# EAGLE design esquema (EAGLE 9.6.2)
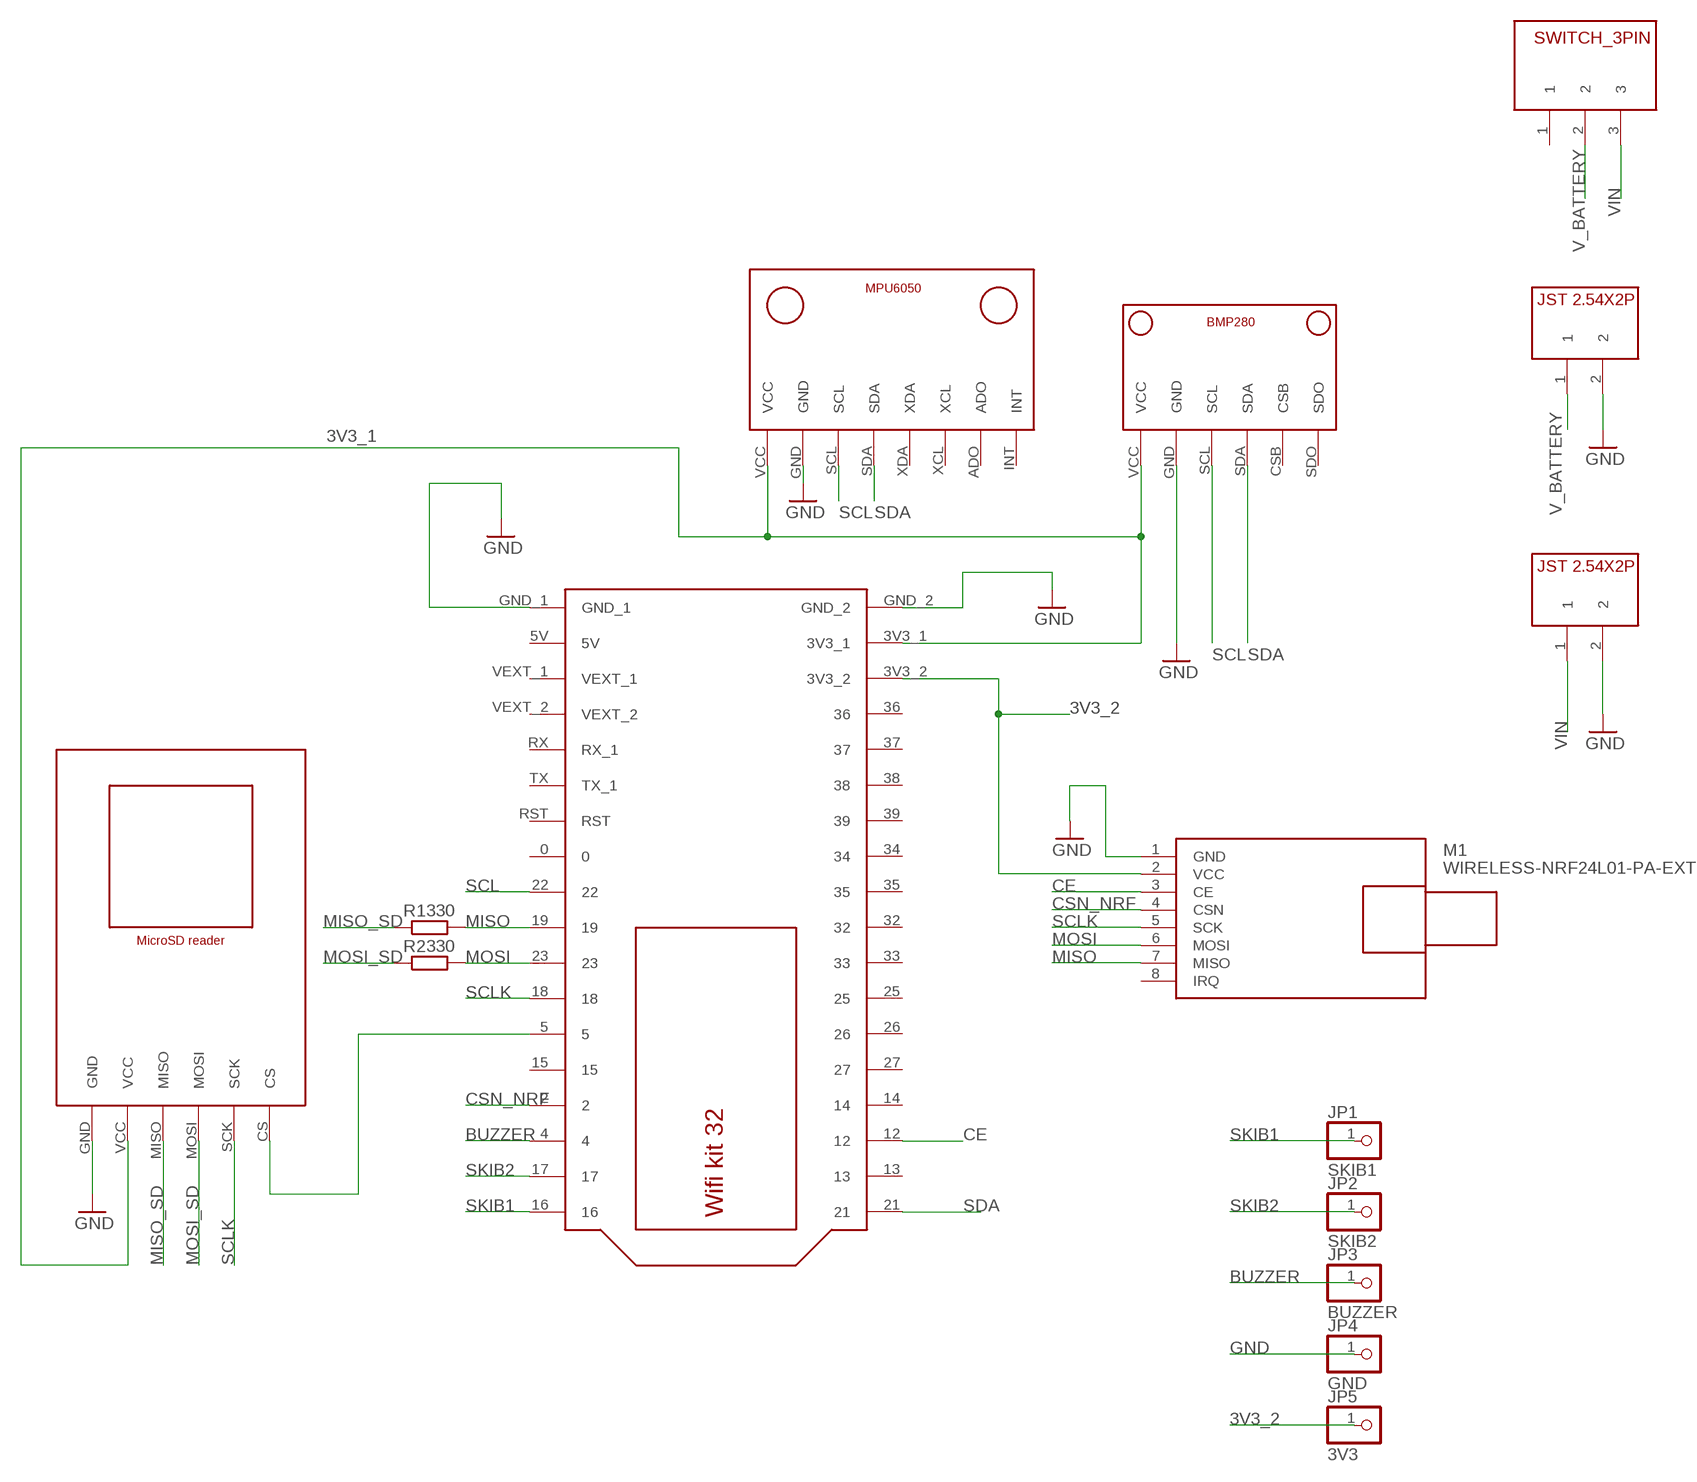
[diagram p0: schematic, sheet 1]

## Parts
JP1  SKIB1  PINHD-1X1  [1X01]
JP2  SKIB2  PINHD-1X1  [1X01]
JP3  BUZZER  PINHD-1X1  [1X01]
JP4  GND  PINHD-1X1  [1X01]
JP5  3V3  PINHD-1X1  [1X01]
M1  WIRELESS-NRF24L01-PA-EXT  [WIRELESS-NRF24L01-PA-EXT]
R1  330  R-EU_0207/10  [0207/10]
R2  330  R-EU_0207/10  [0207/10]
U$1  BMP280V1  [BMP280_FOOTPRINT]
U$2  MICROSD_READER  [MICROSD_READER_FOOTPRINT]
U$3  MPU6050V1  [MPU6050_FOOTPRINT]
U$4  WIFI_KIT32  [WIFI_KIT32]
U$5  JST2.54X2P  [JST2.54X2P_FOOTPRINT]
U$6  SWITCH_3PIN  [SWITCH_3PIN]
U$7  JST2.54X2P  [JST2.54X2P_FOOTPRINT]

## Nets
3V3_1: U$1.VCC U$2.VCC U$3.VCC U$4.3V3_1
3V3_2: JP5.1 M1.2(VCC) U$4.3V3_2
BUZZER: JP3.1 U$4.4
CE: M1.3(CE) U$4.12
CSN_NRF: M1.4(CSN) U$4.2
GND: JP4.1 M1.1(GND) U$1.GND U$2.GND U$3.GND U$4.GND_1 U$4.GND_2 U$5.2 U$7.2
MISO: M1.7(MISO) R1.2 U$4.19
MISO_SD: R1.1 U$2.MISO
MOSI: M1.6(MOSI) R2.2 U$4.23
MOSI_SD: R2.1 U$2.MOSI
N$1: U$2.CS U$4.5
SCL: U$1.SCL U$3.SCL U$4.22
SCLK: M1.5(SCK) U$2.SCK U$4.18
SDA: U$1.SDA U$3.SDA U$4.21
SKIB1: JP1.1 U$4.16
SKIB2: JP2.1 U$4.17
V_BATTERY: U$5.1 U$6.2
VIN: U$6.3 U$7.1
Unconnected: M1.8(IRQ) U$1.CSB U$1.SDO U$3.ADO U$3.INT U$3.XCL U$3.XDA U$4.0 U$4.5V U$4.13 U$4.14 U$4.15 U$4.25 U$4.26 U$4.27 U$4.32 U$4.33 U$4.34 U$4.35 U$4.36 U$4.37 U$4.38 U$4.39 U$4.RST U$4.RX(RX_1) U$4.TX(TX_1) U$4.VEXT_1 U$4.VEXT_2 U$6.1

## Library data of the parts
JP1-JP5 = pinhead:PINHD-1X1: PIN HEADER
M1 = modules:WIRELESS-NRF24L01-PA-EXT: 2.4 GHz Wireless Module based on NRF24L01 chip with preamplifier and external antenna Click here to find device on ebay.com <http://www.ebay.com/sch/nrf24l01+pa+lna+sma>
R1 R2 = rcl:R-EU_: RESISTOR, European symbol; SPICEPREFIX: R
U$1 = CRD:BMP280: Sensor barométrico
U$2 = CRD:MICROSD_READER: Leitor e gravador de cartão SD
U$3 = CRD:MPU6050: Acelerômetro e Giroscópio
U$4 = CRD:WIFI_KIT32: Placa de desenvolvimento ESP32 da Heltech
U$5 U$7 = CRD:JST2.54X2P: Conector JST 2 pinos (2.54mm de distância entre pinos)
U$6 = CRD:SWITCH_3PIN

## Board
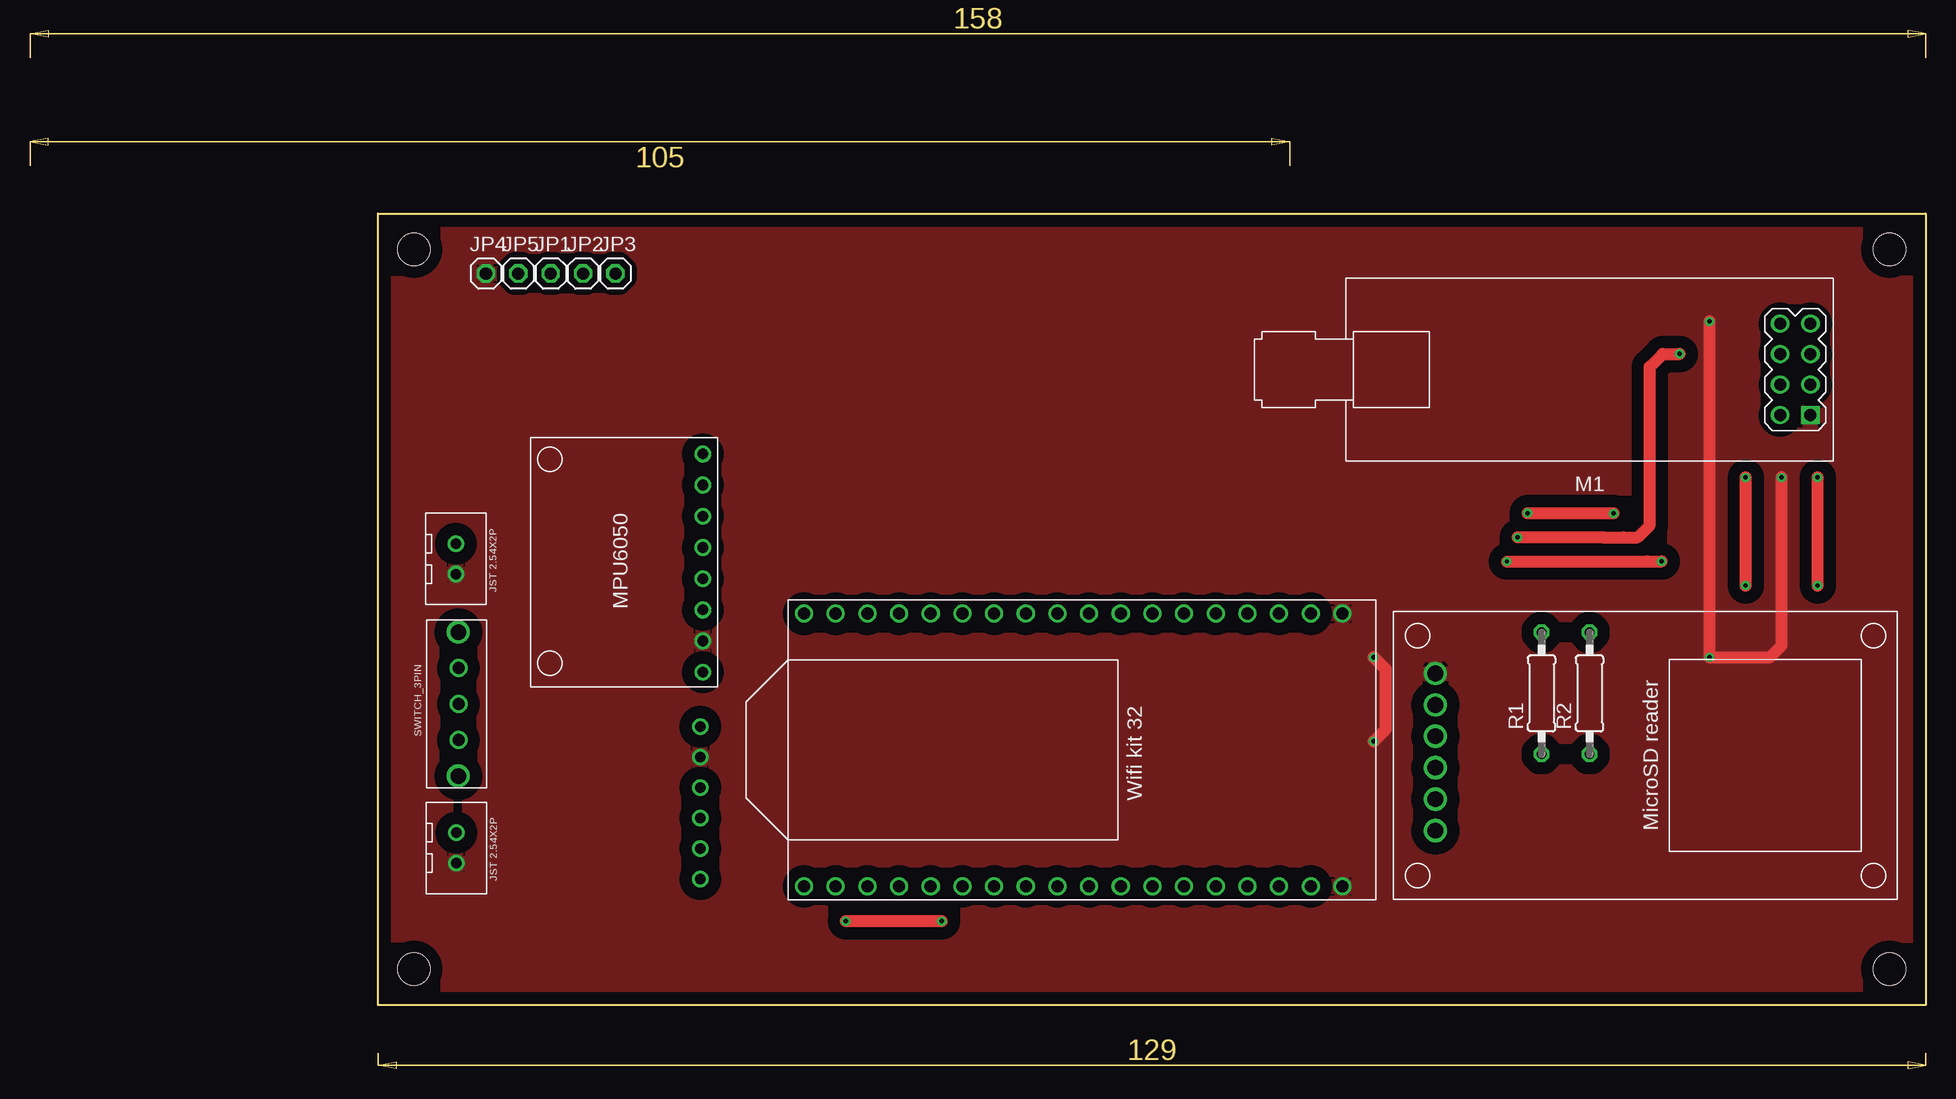
[diagram p1: board, top side]
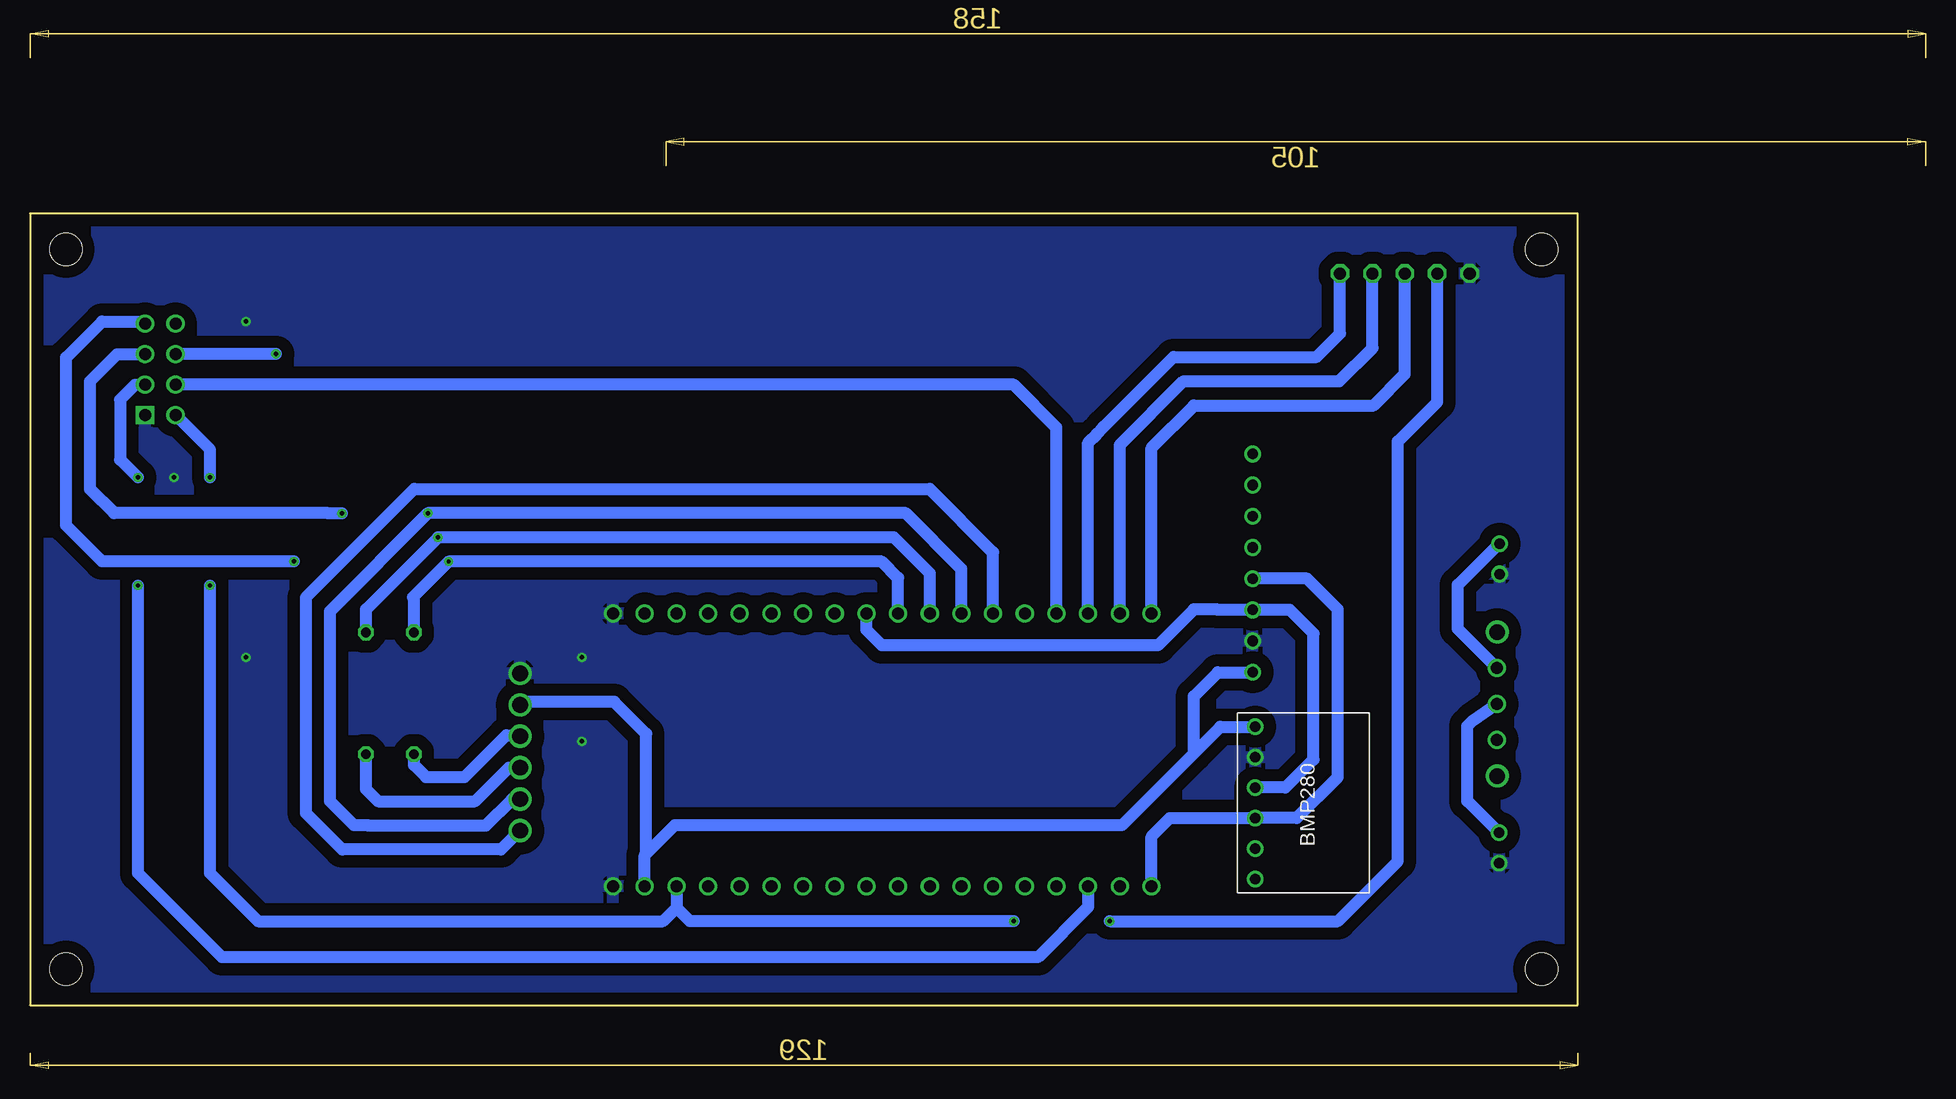
[diagram p2: board, bottom side, seen from below]

Size 129 x 66 mm. Coordinates in mm from the lower left corner, seen from the top.
Outline: 129,66 129,0 0,0 0,66 129,66
Copper layers (1*16): Top 0.035mm / dielectric 1.5mm / Bottom 0.035mm
Design rules "default *": minimum track width 1mm, minimum drill 0.35mm, track to track 40mil, track to pad 0.5mm, pad to pad 6mil, via to via 6mil, smd to smd 6mil, copper to edge 40mil, drill to drill 6mil, minimum pad ring 10mil, minimum via ring 8mil, stop-mask expansion 4mil, vias tented up to drill 0mil, thermal gap 10mil
Holes 2.7 mm at 126,3 126,63 3,3 3,63

### Footprints (pad centres in the part's own frame; a part is rotated, then mirrored left to right if it is on the bottom)
1X01 = drill 1.016 octagon: 1 0,0
WIRELESS-NRF24L01-PA-EXT = drill 1 square: 1 -18.415,3.81 | drill 1: 2 -15.875,3.81; 3 -18.415,1.27; 4 -15.875,1.27; 5 -18.415,-1.27; 6 -15.875,-1.27; 7 -18.415,-3.81; 8 -15.875,-3.81
0207/10 = drill 0.813 octagon: 1 -5.08,0; 2 5.08,0
BMP280_FOOTPRINT = drill 0.891: CSB 3.686,-6.12; GND -3.934,-6.12; SCL -1.395,-6.12; SDA 1.145,-6.12; SDO 6.226,-6.12; VCC -6.474,-6.12
MICROSD_READER_FOOTPRINT = drill 1.3: CS 6.449,-8.692; GND -6.651,-8.692; MISO -1.411,-8.692; MOSI 1.209,-8.692; SCK 3.829,-8.692; VCC -4.031,-8.692
MPU6050_FOOTPRINT = drill 0.891: ADO 6.686,-10.184; GND -6.314,-10.184; INT 9.286,-10.184; SCL -3.715,-10.184; SDA -1.115,-10.184; VCC -8.915,-10.184; XCL 4.085,-10.184; XDA 1.486,-10.184
WIFI_KIT32 = drill 1: 0 11.338,5.28; 2 11.338,23.76; 3V3_1 -11.395,-10.56; 3V3_2 -11.395,-7.92; 4 11.338,26.4; 5 11.338,18.48; 5V 11.338,-10.56; 12 -11.395,26.4; 13 -11.395,29.04; 14 -11.395,23.76; 15 11.338,21.12; 16 11.338,31.68; 17 11.338,29.04; 18 11.338,15.84; 19 11.338,10.56; 21 -11.395,31.68; 22 11.338,7.92; 23 11.338,13.2; 25 -11.395,15.84; 26 -11.395,18.48; 27 -11.395,21.12; 32 -11.395,10.56; 33 -11.395,13.2; 34 -11.395,5.28; 35 -11.395,7.92; 36 -11.395,-5.28; 37 -11.395,-2.64; 38 -11.395,0; 39 -11.395,2.64; GND_1 -11.395,-13.2; GND_2 11.338,-13.2; RST 11.338,2.64; RX 11.338,-2.64; TX 11.338,0; VEXT_1 11.338,-7.92; VEXT_2 11.338,-5.28
JST2.54X2P_FOOTPRINT = drill 0.9: 1 -1.27,0; 2 1.27,0
SWITCH_3PIN = drill 1: 1 -3,-0.018; 2 0,-0.018; 3 3,-0.018 | drill 1.27: P$1 -6,0; P$2 6,0

### Placement (x,y rotation side)
JP1  14.4,61 0 top
JP2  17.1,61 0 top
JP3  19.8,61 0 top
JP4  9,61 0 top
JP5  11.7,61 0 top
M1  101,53 180 top
R1  97,26 90 top
R2  101,26 90 top
U$1  20.75,16.74 270 bottom
U$2  96.84,21 270 top
U$3  16.9,36.67 90 top
U$4  67.2,21.3 90 top
U$5  6.54,13.11 270 top
U$6  6.7,25.1 90 top
U$7  6.5,37.2 270 top

### Tracks (layer width: path | path; a pad name or v marks a point on that pad's centre or on a via)
3V3_1
  Bottom 1: U$3.VCC 30,27.76 32,25.76 32,21 | 32,21 29.79,23.21 U$1.VCC | 32,21 38,15 75.27,15 77.63,12.63 | U$2.VCC 87.88,25.3 80.3,25.3 77.63,22.63 77.63,12.63 | U$4.3V3_1 77.76,12.51 77.63,12.63
3V3_2  (via drill 0.35)
  Top 1: v114,34.98 v114,44 | v47,7 v39,7
  Bottom 1: v114,34.98 114,11 110,7 76.24,7 75.12,8.12 | v114,44 114,46.31 M1.2 | v39,7 20,7 15,12 15,47 11.7,50.3 JP5.1 | v47,7 74,7 75.12,8.12 | U$4.3V3_2 75.12,8.12
BUZZER
  Bottom 1: JP3.1 19.8,56 21.77,54.03 33.67,54.03 39.48,48.22 39.52,48.22 40.07,47.63 40.8,46.9 U$4.4
CE  (via drill 0.35)
  Top 1: v120,34.98 v120,44
  Bottom 1: v120,34.98 120,11 113,4 45,4 40.8,8.2 U$4.12 | M1.3 120.24,51.73 121.48,50.48 121.48,45.48 v120,44
CSN_NRF
  Bottom 1: M1.4 47,51.73 43.44,48.17 U$4.2
GND  (via drill 0.35)
  Top 1: v111,57 v111,29 116,29 117,30 v117,44 | v83,22 84,23 84,28 v83,29
  pour Bottom: 1,65 1,1 128,1 128,65
  pour Top: 128,65 128,1 1,1 1,65
MISO  (via drill 0.35)
  Top 1: v107,37 105.85,37 105.82,36.97 101.33,36.97 101.31,36.98 v94.12,36.98
  Bottom 1: M1.7 119.61,57 123,57 126,54 126,40 123,37 v107,37 | R1.2 97,33.9 97.1,34 v94.12,36.98 58,36.98 56.64,35.62 U$4.19
MISO_SD
  Bottom 1: R1.1 97,20.02 96,19.02 92.78,19.02 89.3,22.5 88.24,22.5 U$2.MISO
MOSI  (via drill 0.35)
  Top 1: v108.5,54.3 107.1,54.3 106,53.2 106,40 105,39 103.85,39 103.83,38.98 102.17,38.98 102.15,39 v95,39
  Bottom 1: v108.5,54.3 116.84,54.3 M1.6 | R2.2 101,33 v95,39 57,39 54,36 U$4.23
MOSI_SD
  Bottom 1: R2.1 101,18 100,17 91.9,17 89.1,19.8 U$2.MOSI
N$1
  Bottom 1: U$2.CS 89.73,12.97 102.97,12.97 106.02,16.02 106.02,33.98 96.97,43.03 54,43.03 48.72,37.75 U$4.5
SCL
  Bottom 1: U$1.SCL 24.37,18.13 22.02,20.48 22.02,30.97 24,32.96 U$3.SCL 30.04,32.96 30.09,33 32,33 35,30 58,30 59.28,31.28 U$4.22
SCLK  (via drill 0.35)
  Top 1: v95.83,41.02 102.98,41.02 v103,41
  Bottom 1: M1.5 121.73,54.27 123.98,52.02 123.98,43 122,41.02 104.17,41.02 104.15,41 v103,41 | U$2.SCK 88.83,17.17 91.02,14.98 100.83,14.98 100.85,15 102,15 104,17 104,32.85 v95.83,41.02 56,41.02 51.36,36.38 U$4.18
SDA
  Bottom 1: U$3.SDA 22.55,35.56 20,33 20,19 23.41,15.6 U$1.SDA 33.99,15.6 35.52,14.07 U$4.21
SKIB1
  Bottom 1: JP1.1 14.4,52.6 17,50 32,50 35.52,46.48 U$4.16
SKIB2
  Bottom 1: U$4.17 38.16,46.69 32.84,52.02 19.88,52.02 17.1,54.8 JP2.1
V_BATTERY
  Bottom 1: U$6.2 8.78,23.68 9.2,23.26 9.2,17 9.16,17 U$5.1
VIN
  Bottom 1: U$7.1 6.53,38.5 10,35.03 10,31.38 U$6.3